# Altium schematic sheet user.SchDoc
size A3
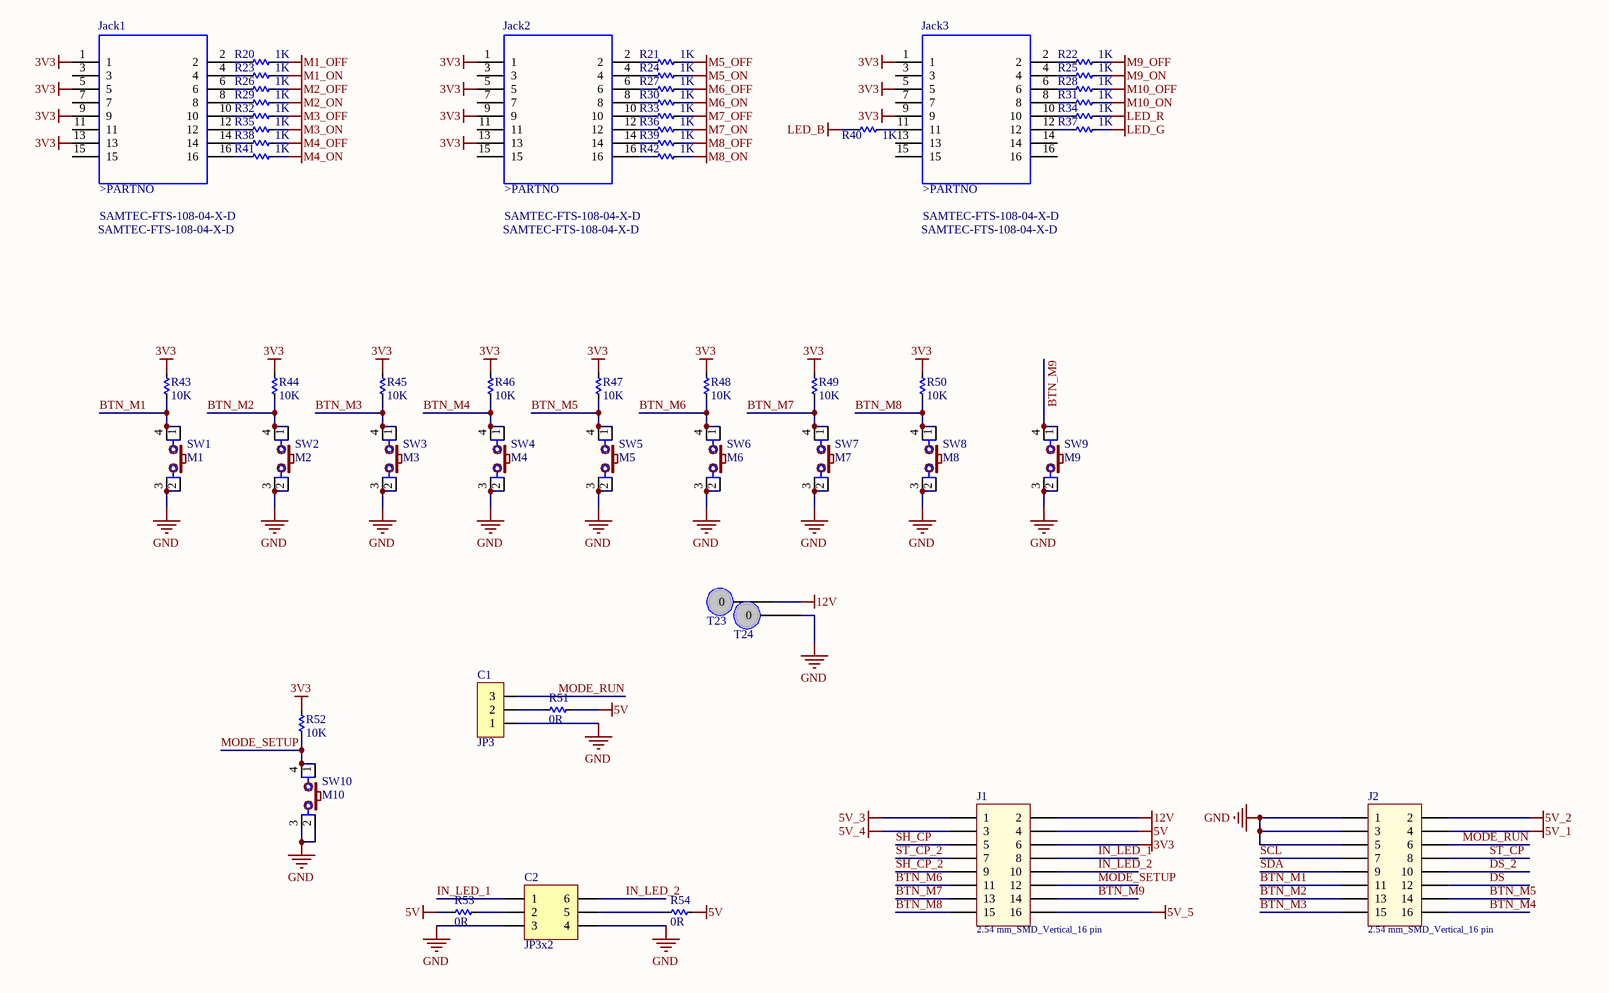
[diagram p0: user.SchDoc]

## Parts
C1  JP3  [JP3-D1C]
C2  JP3x2  [JP3-D2C]
J1  2.54 mm_SMD_Vertical_16 pin  [61031621121]
J2  2.54 mm_SMD_Vertical_16 pin  [61031621121]
Jack1  SAMTEC-FTS-108-04-X-D  [SAMTEC-FTS-108-04-X-D]
Jack2  SAMTEC-FTS-108-04-X-D  [SAMTEC-FTS-108-04-X-D]
Jack3  SAMTEC-FTS-108-04-X-D  [SAMTEC-FTS-108-04-X-D]
R20  1K  [RES-SMD-0603]
R21  1K  [RES-SMD-0603]
R22  1K  [RES-SMD-0603]
R23  1K  [RES-SMD-0603]
R24  1K  [RES-SMD-0603]
R25  1K  [RES-SMD-0603]
R26  1K  [RES-SMD-0603]
R27  1K  [RES-SMD-0603]
R28  1K  [RES-SMD-0603]
R29  1K  [RES-SMD-0603]
R30  1K  [RES-SMD-0603]
R31  1K  [RES-SMD-0603]
R32  1K  [RES-SMD-0603]
R33  1K  [RES-SMD-0603]
R34  1K  [RES-SMD-0603]
R35  1K  [RES-SMD-0603]
R36  1K  [RES-SMD-0603]
R37  1K  [RES-SMD-0603]
R38  1K  [RES-SMD-0603]
R39  1K  [RES-SMD-0603]
R40  1K  [RES-SMD-0603]
R41  1K  [RES-SMD-0603]
R42  1K  [RES-SMD-0603]
R43  10K  [RES-SMD-0603]
R44  10K  [RES-SMD-0603]
R45  10K  [RES-SMD-0603]
R46  10K  [RES-SMD-0603]
R47  10K  [RES-SMD-0603]
R48  10K  [RES-SMD-0603]
R49  10K  [RES-SMD-0603]
R50  10K  [RES-SMD-0603]
R51  0R  [RES-SMD-0603]
R52  10K  [RES-SMD-0603]
R53  0R  [RES-SMD-0603]
R54  0R  [RES-SMD-0603]
SW1  M1  [SW2-SMD]
SW2  M2  [SW2-SMD]
SW3  M3  [SW2-SMD]
SW4  M4  [SW2-SMD]
SW5  M5  [SW2-SMD]
SW6  M6  [SW2-SMD]
SW7  M7  [SW2-SMD]
SW8  M8  [SW2-SMD]
SW9  M9  [SW2-SMD]
SW10  M10  [SW2-SMD]
T23  Pad  [PCBComponent_1]  (value not drawn)
T24  Pad  [PCBComponent_1]  (value not drawn)

## Nets
3V3: J1.6 Jack1.1 Jack1.5 Jack1.9 Jack1.13 Jack2.1 Jack2.5 Jack2.9 Jack2.13 Jack3.1 Jack3.5 Jack3.9 R43.1 R44.1 R45.1 R46.1 R47.1 R48.1 R49.1 R50.1 R52.1
5V: J1.4 R51.1 R53.2 R54.1
5V_1: J2.4
5V_2: J2.2
5V_3: J1.1
5V_4: J1.3
5V_5: J1.16
12V: J1.2 T23.0
GND: C1.1 C2.3 C2.4 J2.1 J2.3 J2.5 SW1.2 SW1.3 SW2.2 SW2.3 SW3.2 SW3.3 SW4.2 SW4.3 SW5.2 SW5.3 SW6.2 SW6.3 SW7.2 SW7.3 SW8.2 SW8.3 SW9.2 SW9.3 SW10.2 SW10.3 T24.0
LED_B: R40.2
LED_G: R37.2
LED_R: R34.2
M1_OFF: R20.2
M1_ON: R23.2
M2_OFF: R26.2
M2_ON: R29.2
M3_OFF: R32.2
M3_ON: R35.2
M4_OFF: R38.2
M4_ON: R41.2
M5_OFF: R21.2
M5_ON: R24.2
M6_OFF: R27.2
M6_ON: R30.2
M7_OFF: R33.2
M7_ON: R36.2
M8_OFF: R39.2
M8_ON: R42.2
M9_OFF: R22.2
M9_ON: R25.2
M10_OFF: R28.2
M10_ON: R31.2
BTN_M1: J2.11 R43.2 SW1.1 SW1.4
BTN_M2: J2.13 R44.2 SW2.1 SW2.4
BTN_M3: J2.15 R45.2 SW3.1 SW3.4
BTN_M4: J2.16 R46.2 SW4.1 SW4.4
BTN_M5: J2.14 R47.2 SW5.1 SW5.4
BTN_M6: J1.11 R48.2 SW6.1 SW6.4
BTN_M7: J1.13 R49.2 SW7.1 SW7.4
BTN_M8: J1.15 R50.2 SW8.1 SW8.4
BTN_M9: J1.14 SW9.1 SW9.4
DS: J2.12
DS_2: J2.10
IN_LED_1: C2.1 J1.8
IN_LED_2: C2.6 J1.10
MODE_RUN: C1.3 J2.6
MODE_SETUP: J1.12 R52.2 SW10.1 SW10.4
SCL: J2.7
SDA: J2.9
SH_CP: J1.5
SH_CP_2: J1.9
ST_CP: J2.8
ST_CP_2: J1.7
NetC1_2: C1.2 R51.2
NetC2_2: C2.2 R53.1
NetC2_5: C2.5 R54.2
NetJack1_2: Jack1.2 R20.1
NetJack1_4: Jack1.4 R23.1
NetJack1_6: Jack1.6 R26.1
NetJack1_8: Jack1.8 R29.1
NetJack1_10: Jack1.10 R32.1
NetJack1_12: Jack1.12 R35.1
NetJack1_14: Jack1.14 R38.1
NetJack1_16: Jack1.16 R41.1
NetJack2_2: Jack2.2 R21.1
NetJack2_4: Jack2.4 R24.1
NetJack2_6: Jack2.6 R27.1
NetJack2_8: Jack2.8 R30.1
NetJack2_10: Jack2.10 R33.1
NetJack2_12: Jack2.12 R36.1
NetJack2_14: Jack2.14 R39.1
NetJack2_16: Jack2.16 R42.1
NetJack3_2: Jack3.2 R22.1
NetJack3_4: Jack3.4 R25.1
NetJack3_6: Jack3.6 R28.1
NetJack3_8: Jack3.8 R31.1
NetJack3_10: Jack3.10 R34.1
NetJack3_11: Jack3.11 R40.1
NetJack3_12: Jack3.12 R37.1

Not connected (* = marked no-connect by the designer): Jack1 3 7 11 15; Jack2 3 7 11 15; Jack3 3 7 13 14 15 16

## Notes on the sheet
- (in symbol SAMTEC-FTS-108-04-X-D) >PARTNO

## Library data of the parts
C1 = JP3: WR-PHD 2.54 mm Angled Socket Header; Manufacturer: W¨¹rth Elektronik eiSos GmbH; partNo: 613003143121; ComponentLink1 Description: Manufacturer; ComponentLink2 Description: Datasheet; NoPins: 03; Created Date: 29 March 2013; ComponentLink1URL: http://www.we-online.com; ComponentLink2URL: http://katalog.we-online.de/em/datasheet/6130xx143121.pdf; Created by: Karrer Zheng
C2 = JP3x2: WR-PHD 2.54 mm Dual Socket Header; Manufacturer: W¨¹rth Elektronik eiSos GmbH; partNo: 61300621821; ComponentLink1 Description: Manufacturer; ComponentLink2 Description: Datasheet; NoPins: 06; Created Date: 29 March 2013; ComponentLink1URL: http://www.we-online.com; ComponentLink2URL: http://katalog.we-online.de/em/datasheet/6130xx21821.pdf; Created by: Karrer Zheng
J1 J2 = 61031621121: Pin Header WR-PHD, pitch 2.54 mm, SMD, Vertical, dual row, 16 pin; Rated Current: 3 A; Pin Number: 16; Pitch: 2.54 mm; Working Voltage: 250 VAC; Contact Resistance: 20 mOhm; Insulation Resistance: >1000 MOhm; ComponentLink1Description: Manufacturer; ComponentLink1URL: http://www.we-online.de; ComponentLink2Description: Datasheet; ComponentLink2URL: http://katalog.we-online.de/em/datasheet/6103xx21121.pdf; Part Number: 61031621121; Published Date: Jan. 2018; Publisher: Wurth Elektronik; Operating Temperature: -40 to 125 degC; Mounting Technology: SMD; Row Number: Dual; Orientation: Vertical
R20-R54 = Res-SMD: Resistor; Manufacturer: Generic Components; Class: Passive; Published: 08/06/2000; Publisher: Altium Hobart Technology Centre
SW1-SW10 = SW4: Switch button 4 pin; Value: Button chip 4 pin
T23 T24 = Component_1
Jack1-Jack3 = SAMTEC-FTS-108-04-X-D: Package: None; Price: None; Value: *; MP: SAMTEC-FTS-108-04-X-D; Availability: Unavailable